# EAGLE design HominiPulseSensorBatt (EAGLE 8.0.1)
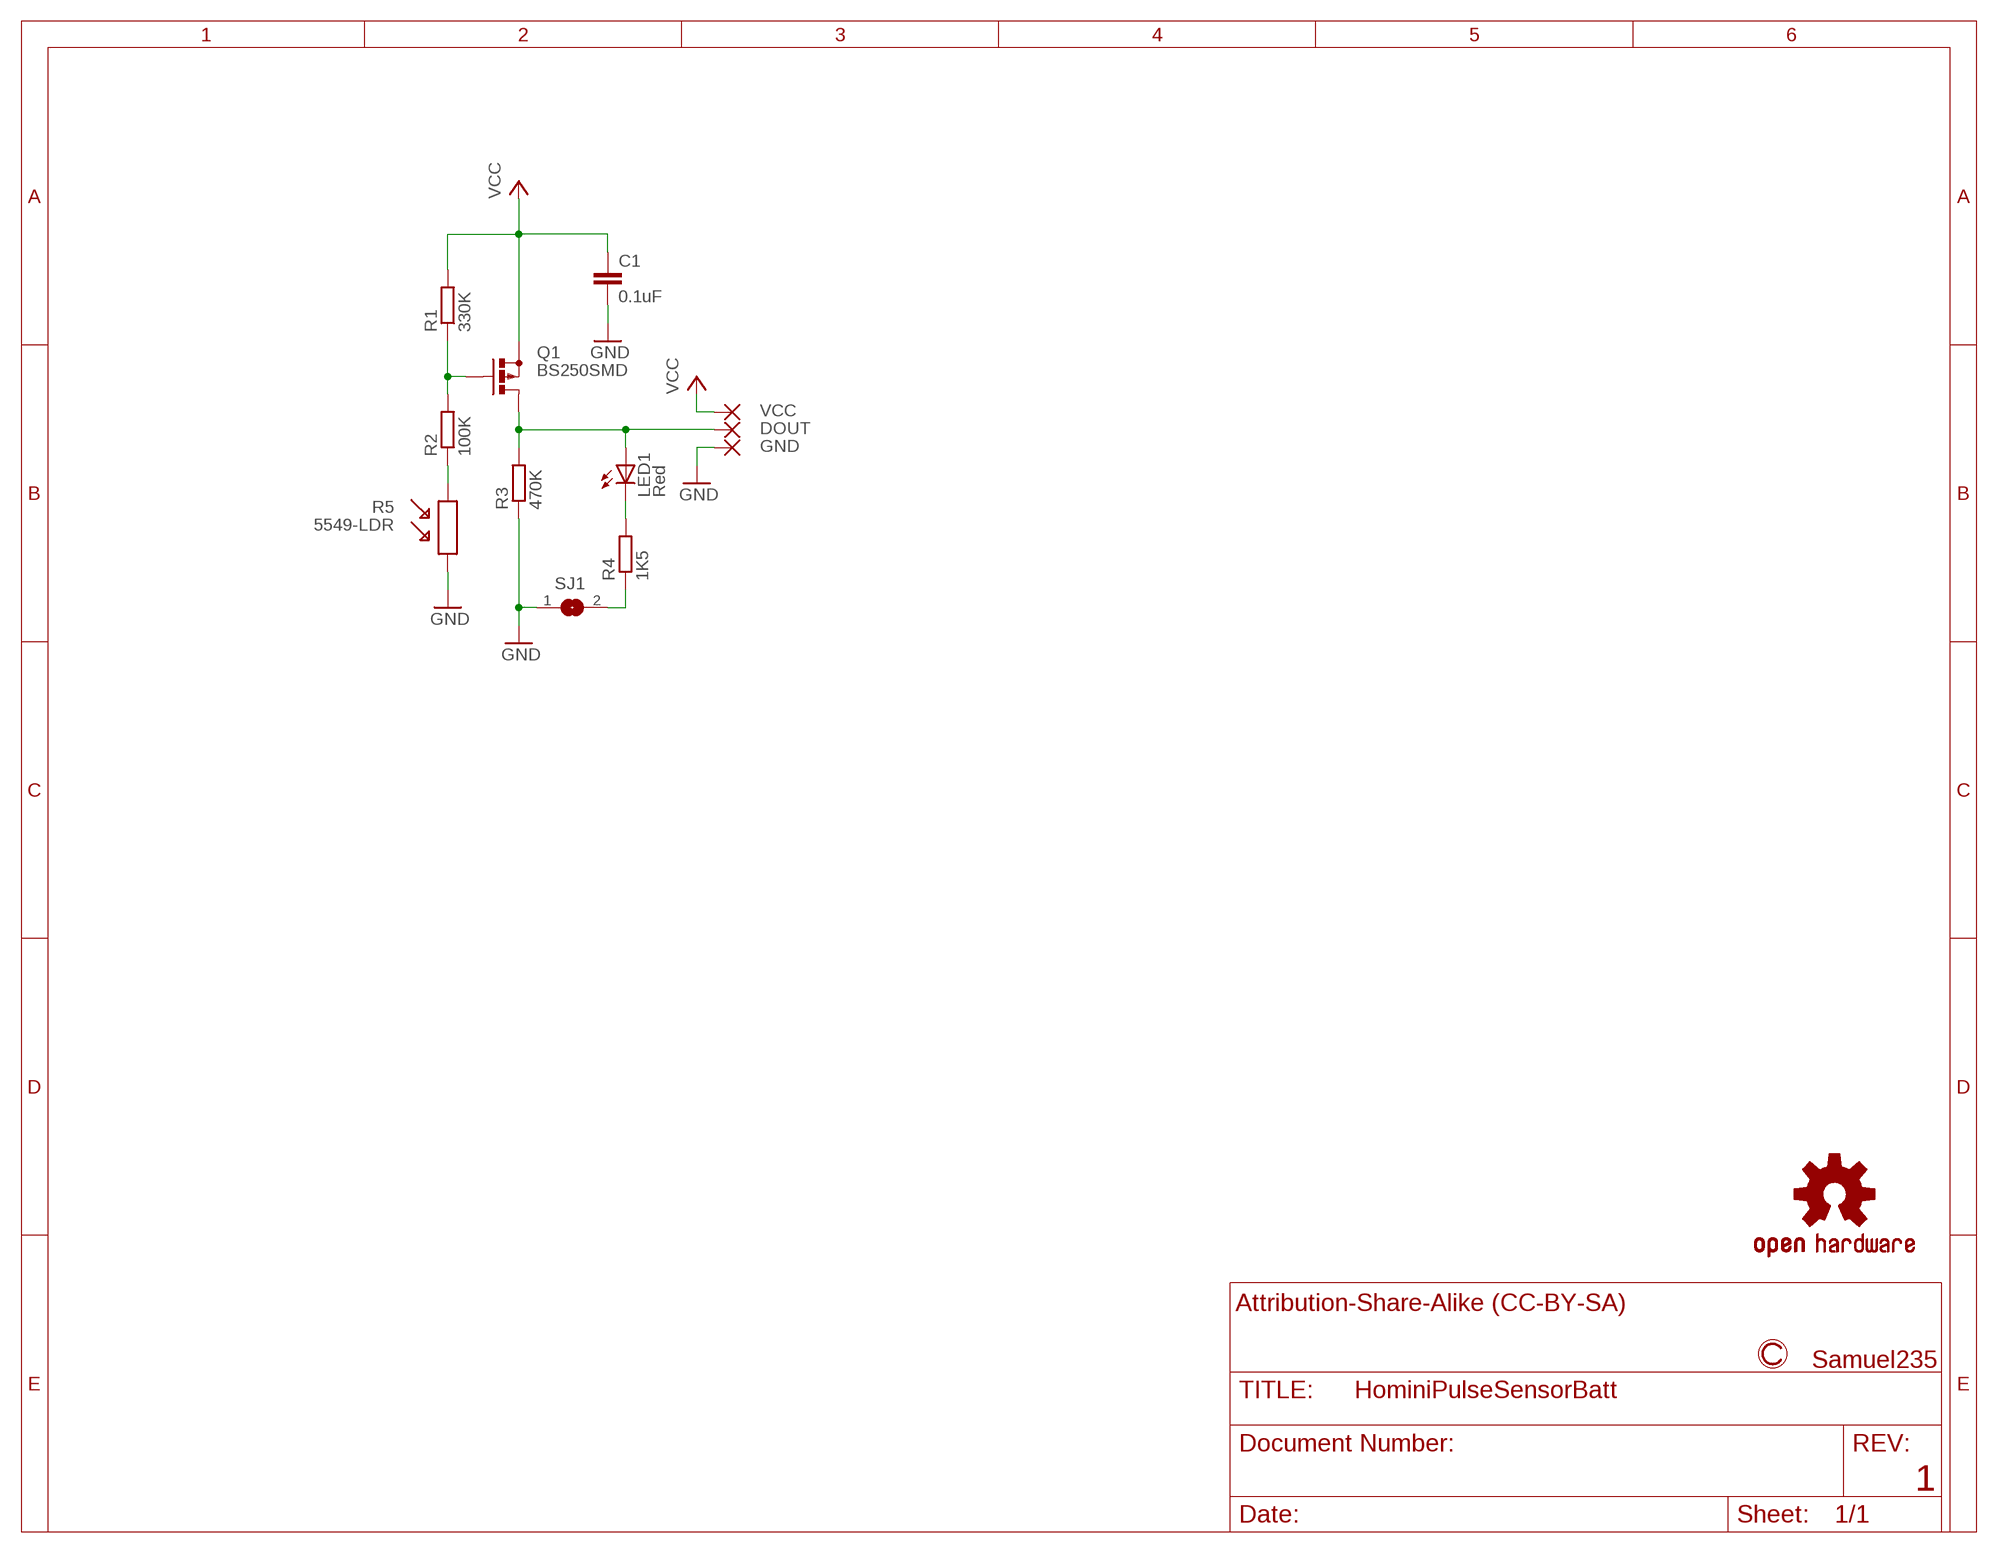
[diagram p0: schematic, sheet 1]

## Parts
C1  0.1uF  C-EUC0603  [C0603]
DOUT  SMD2  [SMD1,27-2,54]
GND  SMD2  [SMD1,27-2,54]
LED1  Red  LED3MM  [LED3MM]
LOGO1  OSHW-LOGOS  [OSHW-LOGO-S]
Q1  BS250SMD  [SOT23]
R1  330K  R-EU_R0603  [R0603]
R2  100K  R-EU_R0603  [R0603]
R3  470K  R-EU_R0603  [R0603]
R4  1K5  R-EU_R0603  [R0603]
R5  5549-LDR  [LDR-PTH]
SJ1  SJ  [SJ]
VCC  SMD2  [SMD1,27-2,54]

## Nets
GND: C1.2 GND.1(P) R3.1 R5.1 SJ1.1
N$1: Q1.1(G) R1.1 R2.2
N$2: R2.1 R5.2
N$3: DOUT.1(P) LED1.A Q1.3(D) R3.2
N$4: R4.1 SJ1.2
N$5: LED1.K(C) R4.2
VCC: C1.1 Q1.2(S) R1.2 VCC.1(P)

## Notes on the sheet
- Attribution-Share-Alike (CC-BY-SA)
- Samuel235
- 1

## Library data of the parts
C1 = rcl:C-EU: CAPACITOR, European symbol
DOUT GND VCC = wirepad:SMD2: SMD PAD
LED1 = adafruit:LED: LED OSRAM: - CHIPLED LG R971, LG N971, LY N971, LG Q971, LY Q971, LO R971, LY R971 LH N974, LH R974 LS Q976, LO Q976, LY Q976 LO Q996 - Hyper CHIPLED LW Q18S LB Q993, LB Q99A, LB R99A - SideLED LS A670, LO A670, LY A670, LG A670, LP A670 LB A673, LV A673, LT A673, LW A673 LH A674 LY A675 LS A676, LA A676, LO A676, LY A676, LW A676 LS A679, LY A679, LG A679 - Hyper Micro SIDELED® LS Y876, LA Y876, LO Y876, LY Y876 LT Y87S - SmartLED LW L88C, LW L88S LB L89C, LB L89S, LG L890 LS L89K, LO L89K, LY L89K LS L896, LA L896, LO L896, LY L896 - TOPLED LS T670, LO T670, LY T670, LG T670, LP T670 LSG T670, LSP T670, LSY T670, LOP T670, LYG T670 LG T671, LOG T671, LSG T671 LB T673, LV T673, LT T673, LW T673 LH T674 LS T676, LA T676, LO T676, LY T676, LB T676, LH T676, LSB T676, LW T676 LB T67C, LV T67C, LT T67C, LS T67K, LO T67K, LY T67K, LW E67C LS E67B, LA E67B, LO E67B, LY E67B, LB E67C, LV E67C, LT E67C LW T67C LS T679, LY T679, LG T679 LS T770, LO T770, LY T770, LG T770, LP T770 LB T773, LV T773, LT T773, LW T773 LH T774 LS E675, LA E675, LY E675, LS T675 LS T776, LA T776, LO T776, LY T776, LB T776 LHGB T686 LT T68C, LB T68C - Hyper Mini TOPLED® LB M676 - Mini TOPLED Santana® LG M470 LS M47K, LO M47K, LY M47K Source: http://www.osram.convergy.de/
LOGO1 = SparkFun-Aesthetics:OSHW-LOGO: Open-Source Hardware (OSHW) Logo This logo indicates the piece of hardware it is found on incorporates a OSHW license and/or adheres to the definition of open source hardware found here: http://freedomdefined.org/OSHW
Q1 = transistor-small-signal:BS250: P-CHANNEL MOS FET
R1-R4 = rcl:R-EU_: RESISTOR, European symbol
R5 = Misc:5549-LDR
SJ1 = jumper:SJ: SMD solder JUMPER

## Board
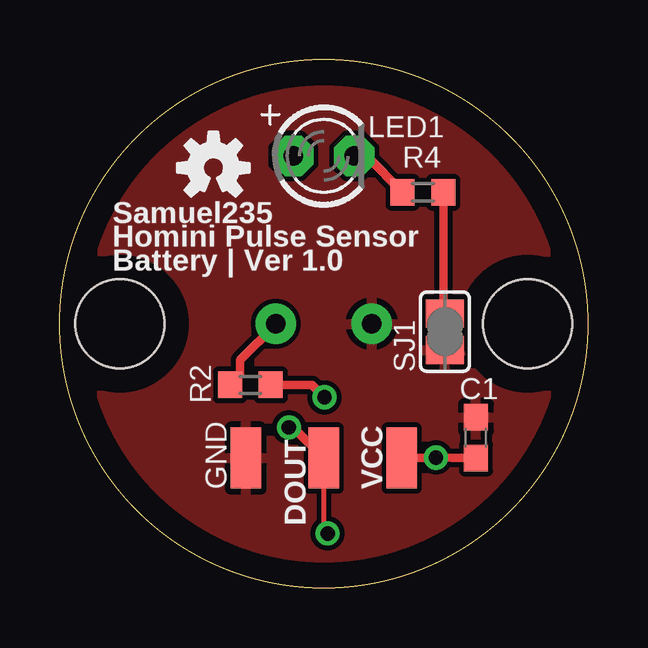
[diagram p1: board, top side]
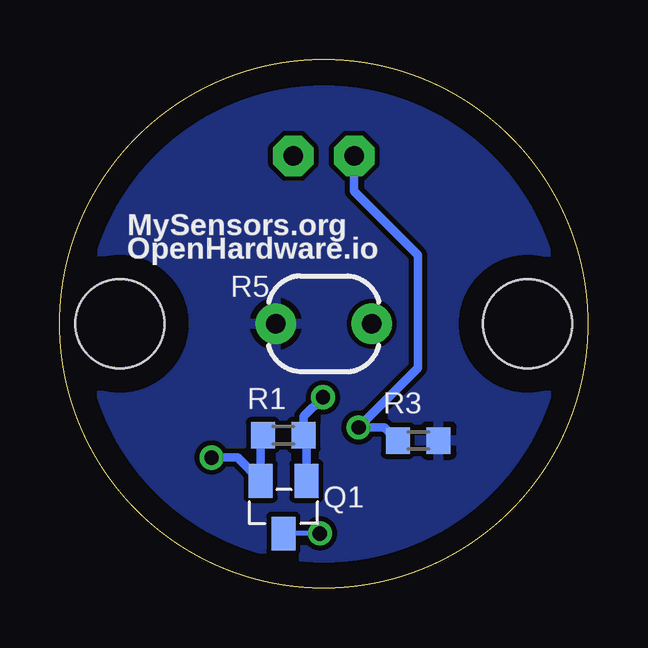
[diagram p2: board, bottom side, seen from below]

Size 22 x 22 mm. Coordinates in mm from the lower left corner, seen from the top.
Outline: circle at 11,11 radius 11
Copper layers (1*16): Top 0.035mm / dielectric 1.5mm / Bottom 0.035mm
Design rules "default *": minimum track width 10mil, minimum drill 0.3mm, track to track 8mil, track to pad 8mil, pad to pad 8mil, via to via 8mil, smd to smd 8mil, copper to edge 40mil, drill to drill 8mil, minimum pad ring 10mil, minimum via ring 8mil, stop-mask expansion 4mil, vias tented up to drill 0mil, thermal gap 10mil
Holes 3.7 mm at 2.5,11 19.5,11

### Footprints (pad centres in the part's own frame; a part is rotated, then mirrored left to right if it is on the bottom)
C0603 = smd 1.1 x 1: 1 -0.85,0; 2 0.85,0
SMD1,27-2,54 = smd 1.27 x 2.54: 1 0,0
LED3MM = drill 0.813 pad 1.676 octagon: A -1.27,0; K 1.27,0
SOT23 = smd 1 x 1.4: 1 -0.95,-1.1; 2 0.95,-1.1; 3 0,1.1
R0603 = smd 1 x 1.1: 1 -0.85,0; 2 0.85,0
LDR-PTH = drill 0.8 pad 1.676: 1 -2,0; 2 2,0
SJ = smd 1.168 x 1.6: 1 -0.762,0; 2 0.762,0

### Placement (x,y rotation side)
C1  17.35,6.25 90 top
DOUT  11,5.4 0 top
GND  7.75,5.4 0 top
LED1  11,18 0 top
LOGO1  6.4,17.5 0 top
Q1  12.68,3.35 180 bottom
R1  12.69,6.35 180 bottom
R2  7.94,8.45 0 top
R3  7.06,6.13 180 bottom
R4  15.14,16.48 180 top
R5  11,11 0 bottom
SJ1  16.05,10.67 90 top
VCC  14.25,5.4 0 top

### Tracks (layer width: path | path; a pad name or v marks a point on that pad's centre or on a via)
GND
  pour Top: 2.3,18 4.3,19.8 6.5,21 8.7,21.7 11.6,21.9 14.2,21.5 16.2,20.7 18.1,19.4 19.4,18 20.7,16.2 21.5,14.5 21.9,12.4 22,10.2 21.7,8.2 21,6.3 19.9,4.4 18.6,3 16,1.2 13.8,0.3 11.2,-0.1 8.3,0.2 6.1,1 4.6,1.9 3,3.3 1.2,5.9 0.4,8.1 0,11 0.3,13.6 1.2,16
  pour Bottom: 2.8,18.5 4.6,20 6.6,21 8.4,21.7 10.7,22 13.4,21.7 16,20.8 17.9,19.6 19.3,18.2 20.7,16.2 21.6,14 22,11.6 21.9,9.5 21.5,7.6 20.6,5.4 19.8,4.3 18.9,3.4 17.1,1.8 15.5,1 13.5,0.2 11,0 8.9,0.2 7,0.8 5.5,1.4 4.2,2.3 2.9,3.5 1.8,5 0.9,6.5 0.4,8.1 0,9.7 0,12.1 0.6,14.7 1.6,16.8
N$1  (via drill 0.6)
  Top 0.356: v11.03,7.93 10.52,8.45 R2.2
  Bottom 0.356: Q1.1 11.73,6.24 R1.1 11.84,7.13 v11.03,7.93
N$2
  Top 0.356: R2.1 7.52,8.88 7.52,9.48 9,10.97 R5.2
N$3  (via drill 0.6)
  Top 0.203: DOUT.1 11,2.42 v11.16,2.26
  Top 0.356: DOUT.1 9.72,6.68 v9.55,6.68
  Bottom 0.203: v11.16,2.26 12.67,2.26 Q1.3
  Bottom 0.356: LED1.A 9.73,16.54 7.07,13.87 7.07,9.16 v9.55,6.68 8.46,6.68 R3.2
N$4
  Top 0.356: R4.1 15.99,11.5 SJ1.2
N$5
  Top 0.356: R4.2 12.81,18 LED1.K
VCC  (via drill 0.6)
  Top 0.356: C1.1 16.34,5.4 v15.68,5.42 15.66,5.4 VCC.1
  Bottom 0.356: R1.2 13.63,6.36 Q1.2 14.6,5.42 v15.68,5.42

### Text on the board
tNames: Samuel235 / Homini Pulse Sensor / Battery | Ver 1.0
bNames: MySensors.org / OpenHardware.io